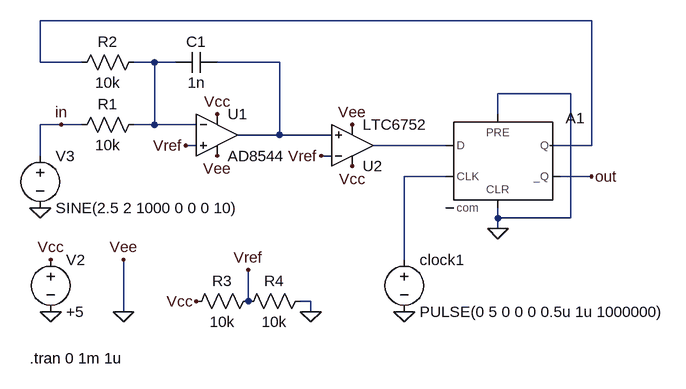
[diagram p0: schematic sigma_delta_adc.asc]
sigma_delta_adc.asc, the LTspice schematic file:
Version 4
SHEET 1 1184 816
WIRE 960 160 112 160
WIRE 112 224 112 160
WIRE 176 224 112 224
WIRE 288 224 256 224
WIRE 320 224 288 224
WIRE 480 224 384 224
WIRE 928 272 816 272
WIRE 816 304 816 272
WIRE 144 320 112 320
WIRE 176 320 144 320
WIRE 288 320 288 224
WIRE 288 320 256 320
WIRE 352 320 288 320
WIRE 480 336 480 224
WIRE 480 336 416 336
WIRE 560 336 480 336
WIRE 352 352 336 352
WIRE 736 352 624 352
WIRE 960 352 960 160
WIRE 960 352 896 352
WIRE 112 368 112 320
WIRE 560 368 544 368
WIRE 736 400 672 400
WIRE 960 400 912 400
WIRE 816 464 816 448
WIRE 928 464 928 272
WIRE 928 464 816 464
WIRE 816 480 816 464
WIRE 672 528 672 400
WIRE 432 592 432 544
WIRE 528 592 512 592
WIRE 240 608 240 528
WIRE 528 608 528 592
FLAG 384 368 Vee
FLAG 128 528 Vcc
FLAG 384 304 Vcc
FLAG 128 608 0
FLAG 352 592 Vcc
FLAG 528 608 0
FLAG 816 480 0
FLAG 672 608 0
FLAG 112 448 0
FLAG 592 320 Vee
FLAG 960 400 out
FLAG 144 320 in
FLAG 432 544 Vref
FLAG 240 608 0
FLAG 240 528 Vee
FLAG 544 368 Vref
FLAG 336 352 Vref
FLAG 592 384 Vcc
SYMBOL voltage 128 512 R0
SYMATTR InstName V2
SYMATTR Value +5
SYMBOL res 272 304 R90
WINDOW 0 0 56 VBottom 2
WINDOW 3 32 56 VTop 2
SYMATTR InstName R1
SYMATTR Value 10k
SYMBOL res 272 208 R90
WINDOW 0 0 56 VBottom 2
WINDOW 3 32 56 VTop 2
SYMATTR InstName R2
SYMATTR Value 10k
SYMBOL res 448 576 R90
WINDOW 0 0 56 VBottom 2
WINDOW 3 32 56 VTop 2
SYMATTR InstName R3
SYMATTR Value 10k
SYMBOL res 528 576 R90
WINDOW 0 0 56 VBottom 2
WINDOW 3 32 56 VTop 2
SYMATTR InstName R4
SYMATTR Value 10k
SYMBOL cap 384 208 R90
WINDOW 0 0 32 VBottom 2
WINDOW 3 32 32 VTop 2
SYMATTR InstName C1
SYMATTR Value 1n
SYMBOL Digital/dflop 816 304 R0
SYMATTR InstName A1
SYMATTR SpiceLine Vhigh=5 Td=5n
SYMBOL voltage 672 512 R0
SYMATTR InstName clock1
SYMATTR Value PULSE(0 5 0 0 0 0.5u 1u 1000000)
SYMBOL voltage 112 352 R0
SYMATTR InstName V3
SYMATTR Value SINE(2.5 2 1000 0 0 0 10)
SYMBOL Comparators/LTC6752 592 416 M180
SYMATTR InstName U2
SYMBOL AD8544 384 272 R0
SYMATTR InstName U1
TEXT 96 680 Left 2 !.tran 0 1m 1u

The netlist it stands for:
* sigma_delta_adc.asc
V2 Vcc 0 +5
R1 N002 in 10k
R2 N002 N001 10k
R3 Vref Vcc 10k
R4 0 Vref 10k
C1 N003 N002 1n
A1 N004 0 N005 0 0 out N001 0 DFLOP Vhigh=5 Td=5n
V§clock1 N005 0 PULSE(0 5 0 0 0 0.5u 1u 1000000)
V3 in 0 SINE(2.5 2 1000 0 0 0 10)
XU2 N003 Vref Vcc 0 N004 LTC6752  ; pins In+ In- V+ V- OUT
* U1: AD8544 (symbol AD8544 not available, pins judged from their places): In+=Vref In-=N002 V+=Vcc V-=0 OUT=N003
.tran 0 1m 1u
.lib LTC7.lib
.backanno
.end